# EAGLE design tact_sw_breakout (EAGLE 7.5.0)
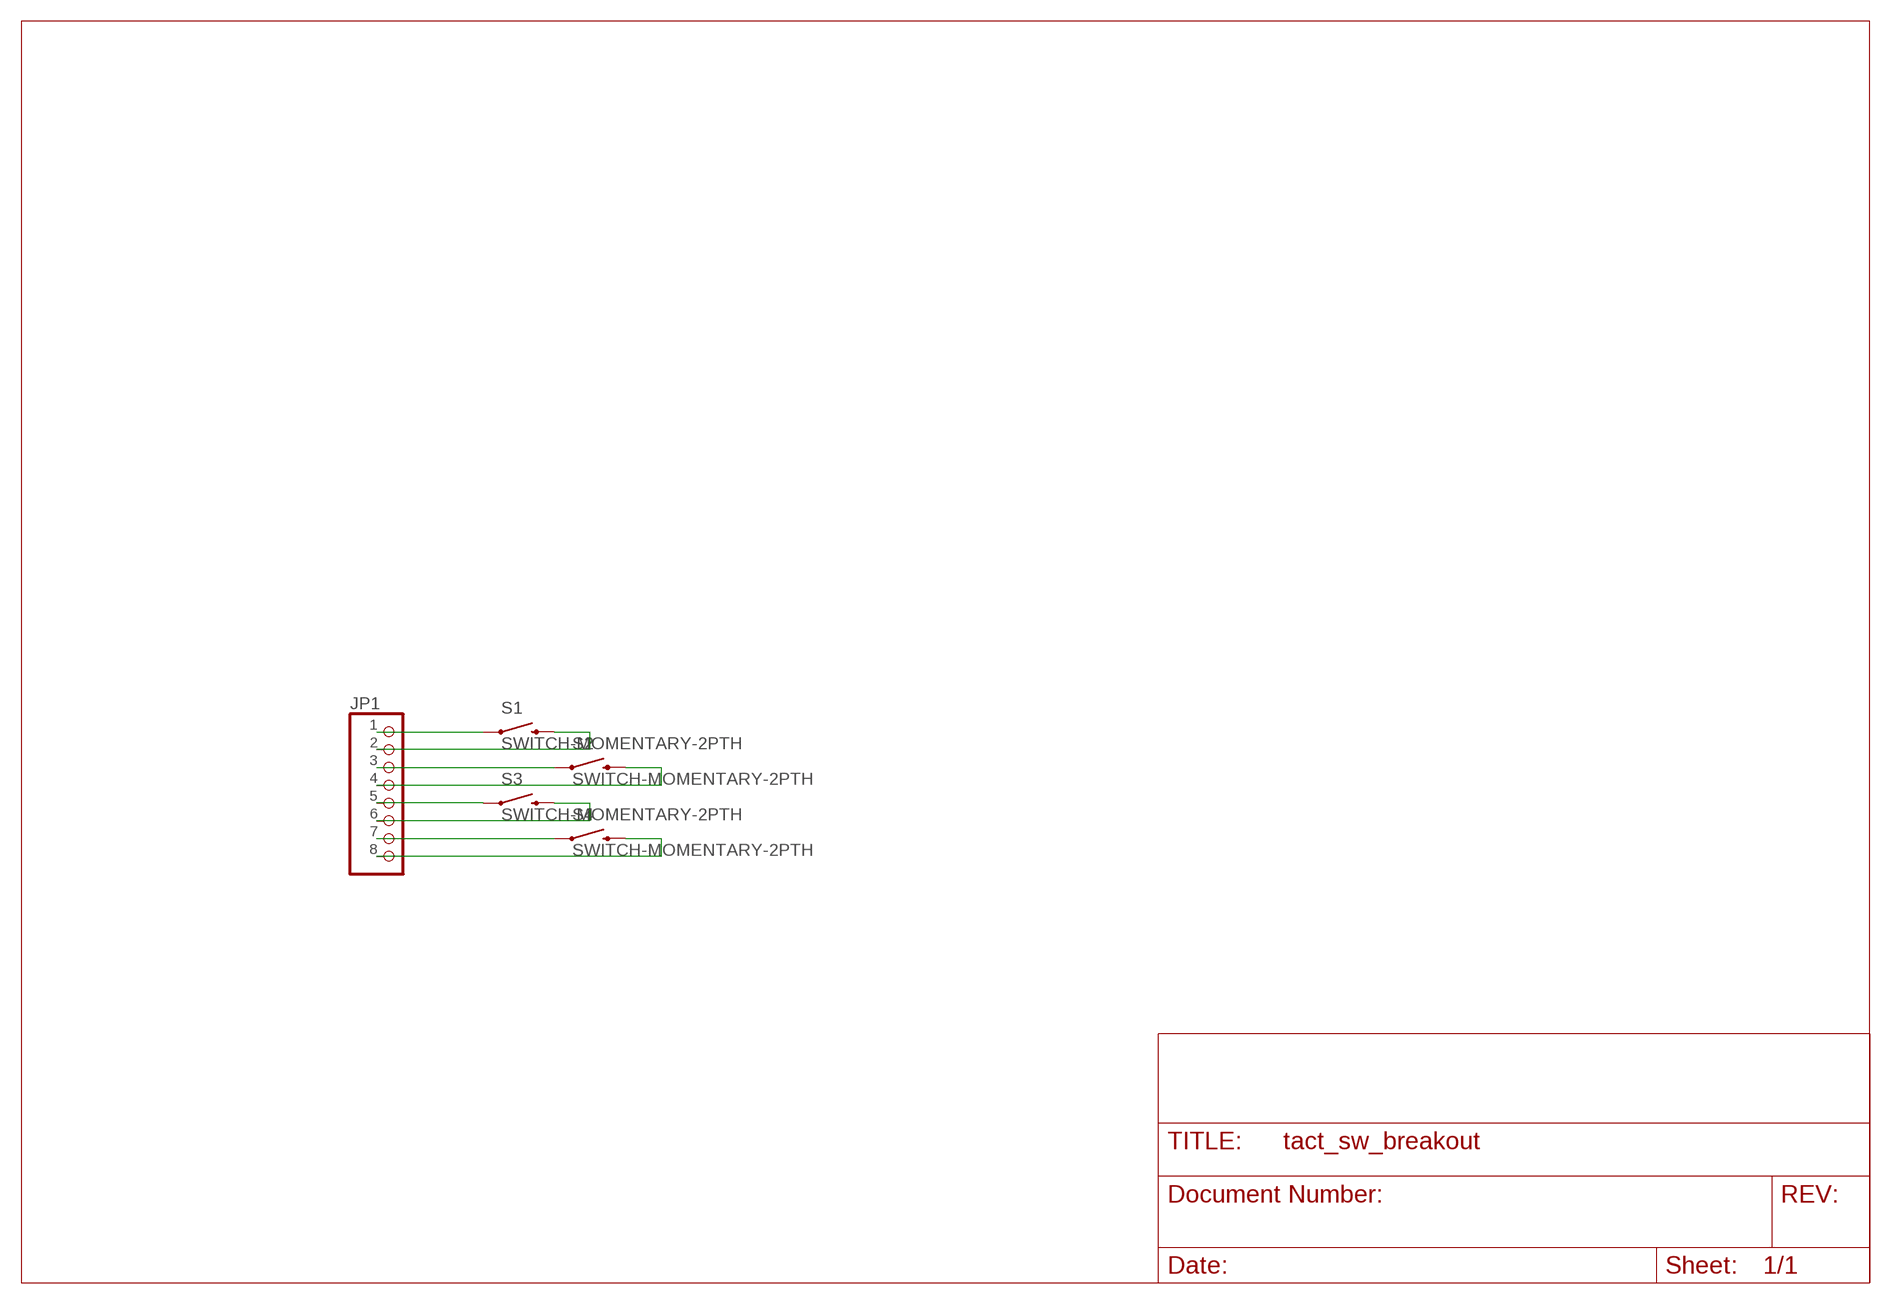
[diagram p0: schematic, sheet 1]

## Parts
JP1  PINHD-1X8  [1X08]
S1  SWITCH-MOMENTARY-2PTH  [TACTILE-PTH]
S2  SWITCH-MOMENTARY-2PTH  [TACTILE-PTH]
S3  SWITCH-MOMENTARY-2PTH  [TACTILE-PTH]
S4  SWITCH-MOMENTARY-2PTH  [TACTILE-PTH]

## Nets
N$1: JP1.1 S1.1
N$2: JP1.2 S1.3
N$3: JP1.3 S2.1
N$4: JP1.5 S3.1
N$5: JP1.7 S4.1
N$6: JP1.4 S2.3
N$7: JP1.6 S3.3
N$8: JP1.8 S4.3

## Library data of the parts
JP1 = pinhead:PINHD-1X8: PIN HEADER
S1-S4 = SparkFun-Electromechanical:SWITCH-MOMENTARY-2: Various NO switches- pushbuttons, reed, etc; PROD_ID: SWCH-08441

## Board
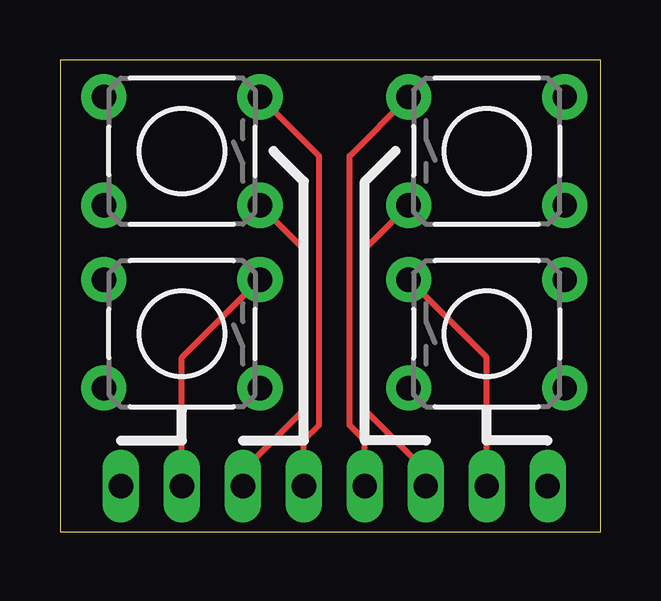
[diagram p1: board, top side]
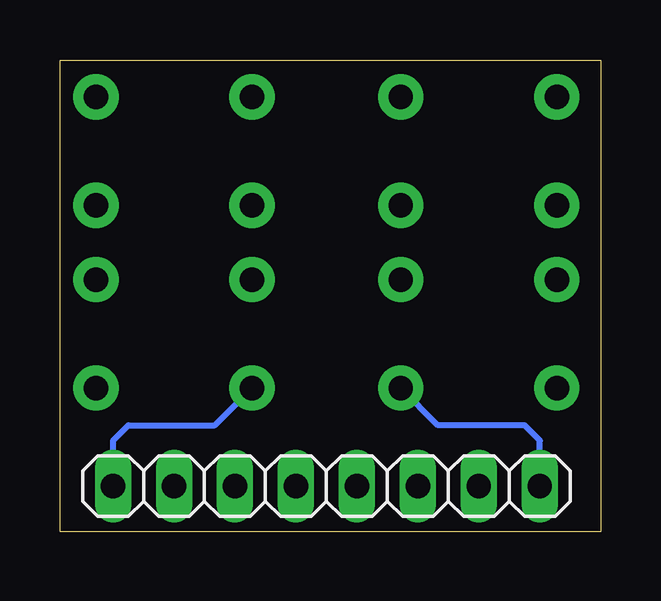
[diagram p2: board, bottom side, seen from below]

Size 22.53 x 19.67 mm. Coordinates in mm from the lower left corner, seen from the top.
Outline: 0,0 22.53,0 22.53,19.67 0,19.67 0,0
Copper layers (1*16): Top 0.0356mm / dielectric 1.5011mm / Bottom 0.0356mm
Design rules "LaenPCBOrder": minimum track width 6mil, minimum drill 13mil, track to track 6mil, track to pad 6mil, pad to pad 6mil, via to via 6mil, smd to smd 6mil, copper to edge 15mil, drill to drill 6mil, minimum pad ring 7mil, minimum via ring 7mil, stop-mask expansion 3mil, vias tented up to drill 0mil, thermal gap 10mil

### Footprints (pad centres in the part's own frame; a part is rotated, then mirrored left to right if it is on the bottom)
1X08 = drill 1.016 long: 1 -8.89,0; 2 -6.35,0; 3 -3.81,0; 4 -1.27,0; 5 1.27,0; 6 3.81,0; 7 6.35,0; 8 8.89,0
TACTILE-PTH = drill 1.016 pad 1.88: 1 -3.251,2.261; 2 3.251,2.261; 3 -3.251,-2.261; 4 3.251,-2.261

### Placement (x,y rotation side)
JP1  11.43,1.91 180 bottom
S1  5.08,8.26 180 top
S2  5.08,15.88 180 top
S3  17.78,15.88 0 top
S4  17.78,8.26 0 top

### Tracks (layer width: path | path; a pad name or v marks a point on that pad's centre or on a via)
N$1
  Bottom 0.254: JP1.1 2.54,3.81 3.17,4.45 6.78,4.45 S1.1
N$2
  Top 0.254: JP1.2 5.08,7.26 S1.3
N$3
  Top 0.254: JP1.3 7.62,2.54 10.16,5.08 10.16,11.79 S2.1
N$4
  Top 0.254: JP1.5 12.7,3.81 12.06,4.45 12.06,15.67 S3.1
N$5
  Top 0.254: JP1.7 17.78,7.26 S4.1
N$6
  Top 0.254: JP1.4 10.16,3.81 10.79,4.45 10.79,15.67 S2.3
N$7
  Top 0.254: JP1.6 15.24,2.54 12.7,5.08 12.7,11.79 S3.3
N$8
  Bottom 0.254: JP1.8 20.32,3.81 19.68,4.45 16.08,4.45 S4.3